# Altium project PCB_Project1.PrjPCB
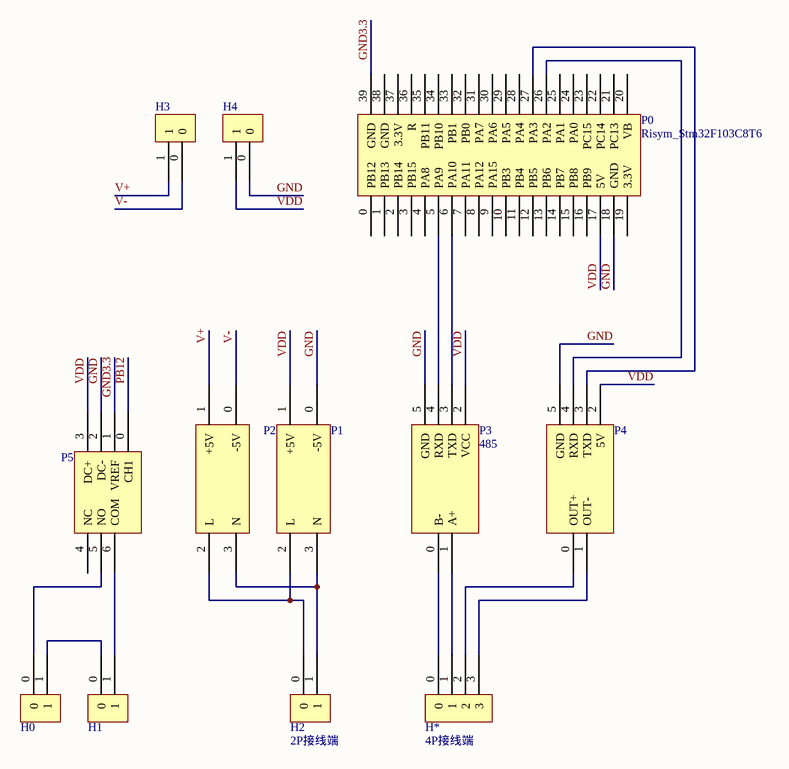
[diagram p0: Sheet1.SchDoc]
1 sheet, 12 parts. Net scope: global (net labels, ports and power ports of the same name join across sheets).

## Sheet Sheet1.SchDoc
size A4

### Parts
H0  2P接线端  (value not drawn)
H1  2P接线端  (value not drawn)
H2  2P接线端
H3  2P接线端  (value not drawn)
H4  2P接线端  (value not drawn)
H*  4P接线端
P0  Risym_Stm32F103C8T6
P1  AC-DC隔离电源-220-5  (value not drawn)
P2  AC-DC隔离电源-220-5  (value not drawn)
P3  485
P4  YS-IR02F  (value not drawn)
P5  Risym_光耦隔离继电器5V  (value not drawn)

### Nets
GND: H4.0 P0.18(GND) P1.0(-5V) P3.5(GND) P4.5(GND) P5.2(DC-)
GND3.3: P0.39(GND) P5.1(VREF)
PB12: P5.0(CH1)
V+: H3.1 P2.1(+5V)
V-: H3.0 P2.0(-5V)
VDD: H4.1 P0.17(5V) P1.1(+5V) P3.2(VCC) P4.2(5V) P5.3(DC+)
NetH0_0: H0.0 P5.5(NO)
NetH0_1: H0.1 H1.0
NetH1_1: H1.1 P5.6(COM)
NetH2_0: H2.0 P1.2(L) P2.2(L)
NetH2_1: H2.1 P1.3(N) P2.3(N)
NetH*_0: H*.0 P3.0(B-)
NetH*_1: H*.1 P3.1(A+)
NetH*_2: H*.2 P4.0(OUT+)
NetH*_3: H*.3 P4.1(OUT-)
NetP0_5: P0.5(PA9) P3.4(RXD)
NetP0_6: P0.6(PA10) P3.3(TXD)
NetP0_26: P0.26(PA2) P4.4(RXD)
NetP0_27: P0.27(PA3) P4.3(TXD)

Not connected (* = marked no-connect by the designer): P0 0(PB12) 1(PB13) 2(PB14) 3(PB15) 4(PA8) 7(PA11) 8(PA12) 9(PA15) 10(PB3) 11(PB4) 12(PB5) 13(PB6) 14(PB7) 15(PB8) 16(PB9) 19(3.3V) 20(VB) 21(PC13) 22(PC14) 23(PC15) 24(PA0) 25(PA1) 28(PA4) 29(PA5) 30(PA6) 31(PA7) 32(PB0) 33(PB1) 34(PB10) 35(PB11) 36(R) 37(3.3V) 38(GND); P5 4(NC)

### Library data of the parts
H0-H4 = 2P接线端: 5.08-1mm
H* = 4P接线端: 5.08-1mm